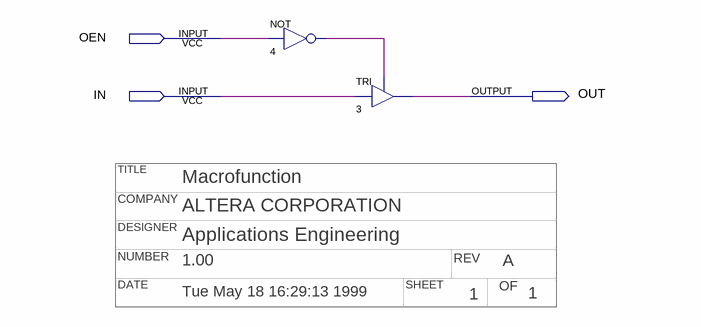
[diagram p0: schematic sheet]
// Quartus schematic btri.bdf as structural Verilog: 2 symbols, 3 pins
// Title block: TITLE: Macrofunction; COMPANY: ALTERA CORPORATION; DESIGNER: Applications Engineering; NUMBER: 1.00; REV: A; DATE: Tue May 18 16:29:13 1999; SHEET: 1; OF: 1
module btri (
  input  OEN,
  input  IN,
  output OUT
);

  wire n4_out;

  not u_4 (n4_out, OEN);
  TRI u_3 (.IN(IN), .OE(n4_out), .OUT(OUT));
endmodule
